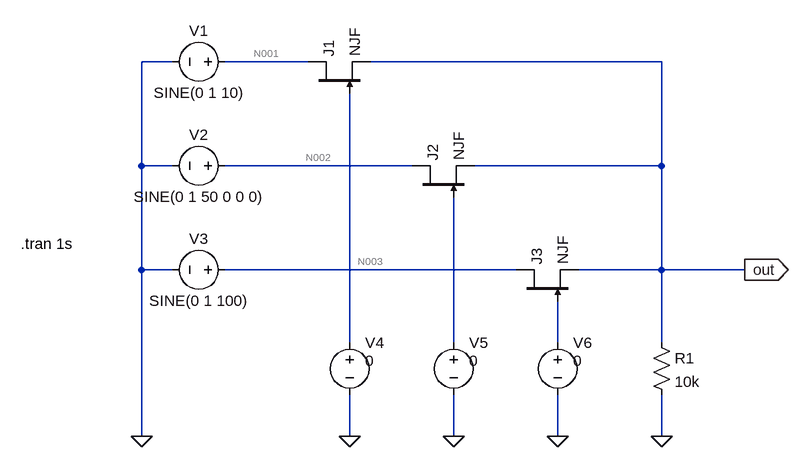
[diagram p0: schematic multiplex-jfet.asc]
multiplex-jfet.asc, the LTspice schematic file:
Version 4
SHEET 1 1168 680
WIRE 192 -16 144 -16
WIRE 400 -16 272 -16
WIRE 944 -16 496 -16
WIRE 144 144 144 -16
WIRE 192 144 144 144
WIRE 560 144 272 144
WIRE 944 144 944 -16
WIRE 944 144 656 144
WIRE 144 304 144 144
WIRE 192 304 144 304
WIRE 720 304 272 304
WIRE 944 304 944 144
WIRE 944 304 816 304
WIRE 1072 304 944 304
WIRE 464 416 464 32
WIRE 624 416 624 192
WIRE 784 416 784 352
WIRE 944 416 944 304
WIRE 144 560 144 304
WIRE 464 560 464 496
WIRE 624 560 624 496
WIRE 784 560 784 496
WIRE 944 560 944 496
FLAG 1072 304 out
IOPIN 1072 304 Out
FLAG 144 560 0
FLAG 464 560 0
FLAG 624 560 0
FLAG 784 560 0
FLAG 944 560 0
SYMBOL voltage 288 -16 R90
WINDOW 0 -32 56 VBottom 2
WINDOW 3 32 56 VTop 2
WINDOW 123 0 0 Left 0
WINDOW 39 0 0 Left 0
SYMATTR InstName V1
SYMATTR Value SINE(0 1 10)
SYMBOL voltage 288 144 R90
WINDOW 0 -32 56 VBottom 2
WINDOW 3 32 56 VTop 2
WINDOW 123 0 0 Left 0
WINDOW 39 0 0 Left 0
SYMATTR InstName V2
SYMATTR Value SINE(0 1 50 0 0 0)
SYMBOL voltage 288 304 R90
WINDOW 0 -32 56 VBottom 2
WINDOW 3 32 56 VTop 2
WINDOW 123 0 0 Left 0
WINDOW 39 0 0 Left 0
SYMATTR InstName V3
SYMATTR Value SINE(0 1 100)
SYMBOL voltage 464 400 R0
WINDOW 3 24 44 Left 2
WINDOW 123 0 0 Left 0
WINDOW 39 0 0 Left 0
SYMATTR InstName V4
SYMATTR Value 0
SYMBOL voltage 624 400 R0
WINDOW 3 24 44 Left 2
WINDOW 123 0 0 Left 0
WINDOW 39 0 0 Left 0
SYMATTR InstName V5
SYMATTR Value 0
SYMBOL voltage 784 400 R0
WINDOW 3 24 44 Left 2
WINDOW 123 0 0 Left 0
WINDOW 39 0 0 Left 0
SYMATTR InstName V6
SYMATTR Value 0
SYMBOL res 928 400 R0
SYMATTR InstName R1
SYMATTR Value 10k
SYMBOL njf 400 32 R270
SYMATTR InstName J1
SYMBOL njf 560 192 R270
SYMATTR InstName J2
SYMBOL njf 720 352 R270
SYMATTR InstName J3
TEXT -42 264 Left 2 !.tran 1s

The netlist it stands for:
* multiplex-jfet.asc
V1 N001 0 SINE(0 1 10)
V2 N002 0 SINE(0 1 50 0 0 0)
V3 N003 0 SINE(0 1 100)
V4 N004 0 0
V5 N005 0 0
V6 N006 0 0
R1 out 0 10k
J1 N001 N004 out NJF
J2 N002 N005 out NJF
J3 N003 N006 out NJF
.model NJF NJF
.model PJF PJF
.lib standard.jft
.tran 1s
.backanno
.end

* Results of the author's LTspice run, read from the files saved beside the schematic
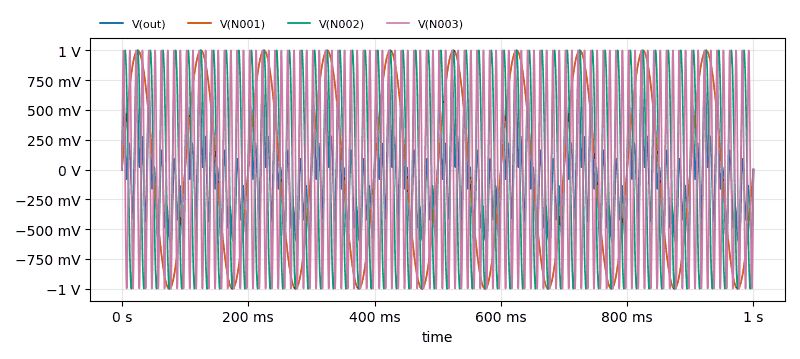
[diagram p1: Transient Analysis of multiplex-jfet.asc, plotted from the saved traces]
* Transient Analysis, 1 run:
*   V(out): min -606.3 mV, max 793.2 mV, average -71.3 mV, rms 357.3 mV, last 0 V
*   V(N001): min -1 V, max 1 V, average 0 V, rms 707.1 mV, last 0 V
*   V(N002): min -999.9 mV, max 999.9 mV, average 505.1 nV, rms 708.4 mV, last 0 V
*   V(N003): min -997.8 mV, max 999.5 mV, average 878.9 µV, rms 713.1 mV, last 0 V